# EasyEDA schematic Zad1SpaceSystems.json
TITLE: Zad1_STM32; REV: 1.0; Date: 2022-11-03; Sheet: 1/1; Company: AGH
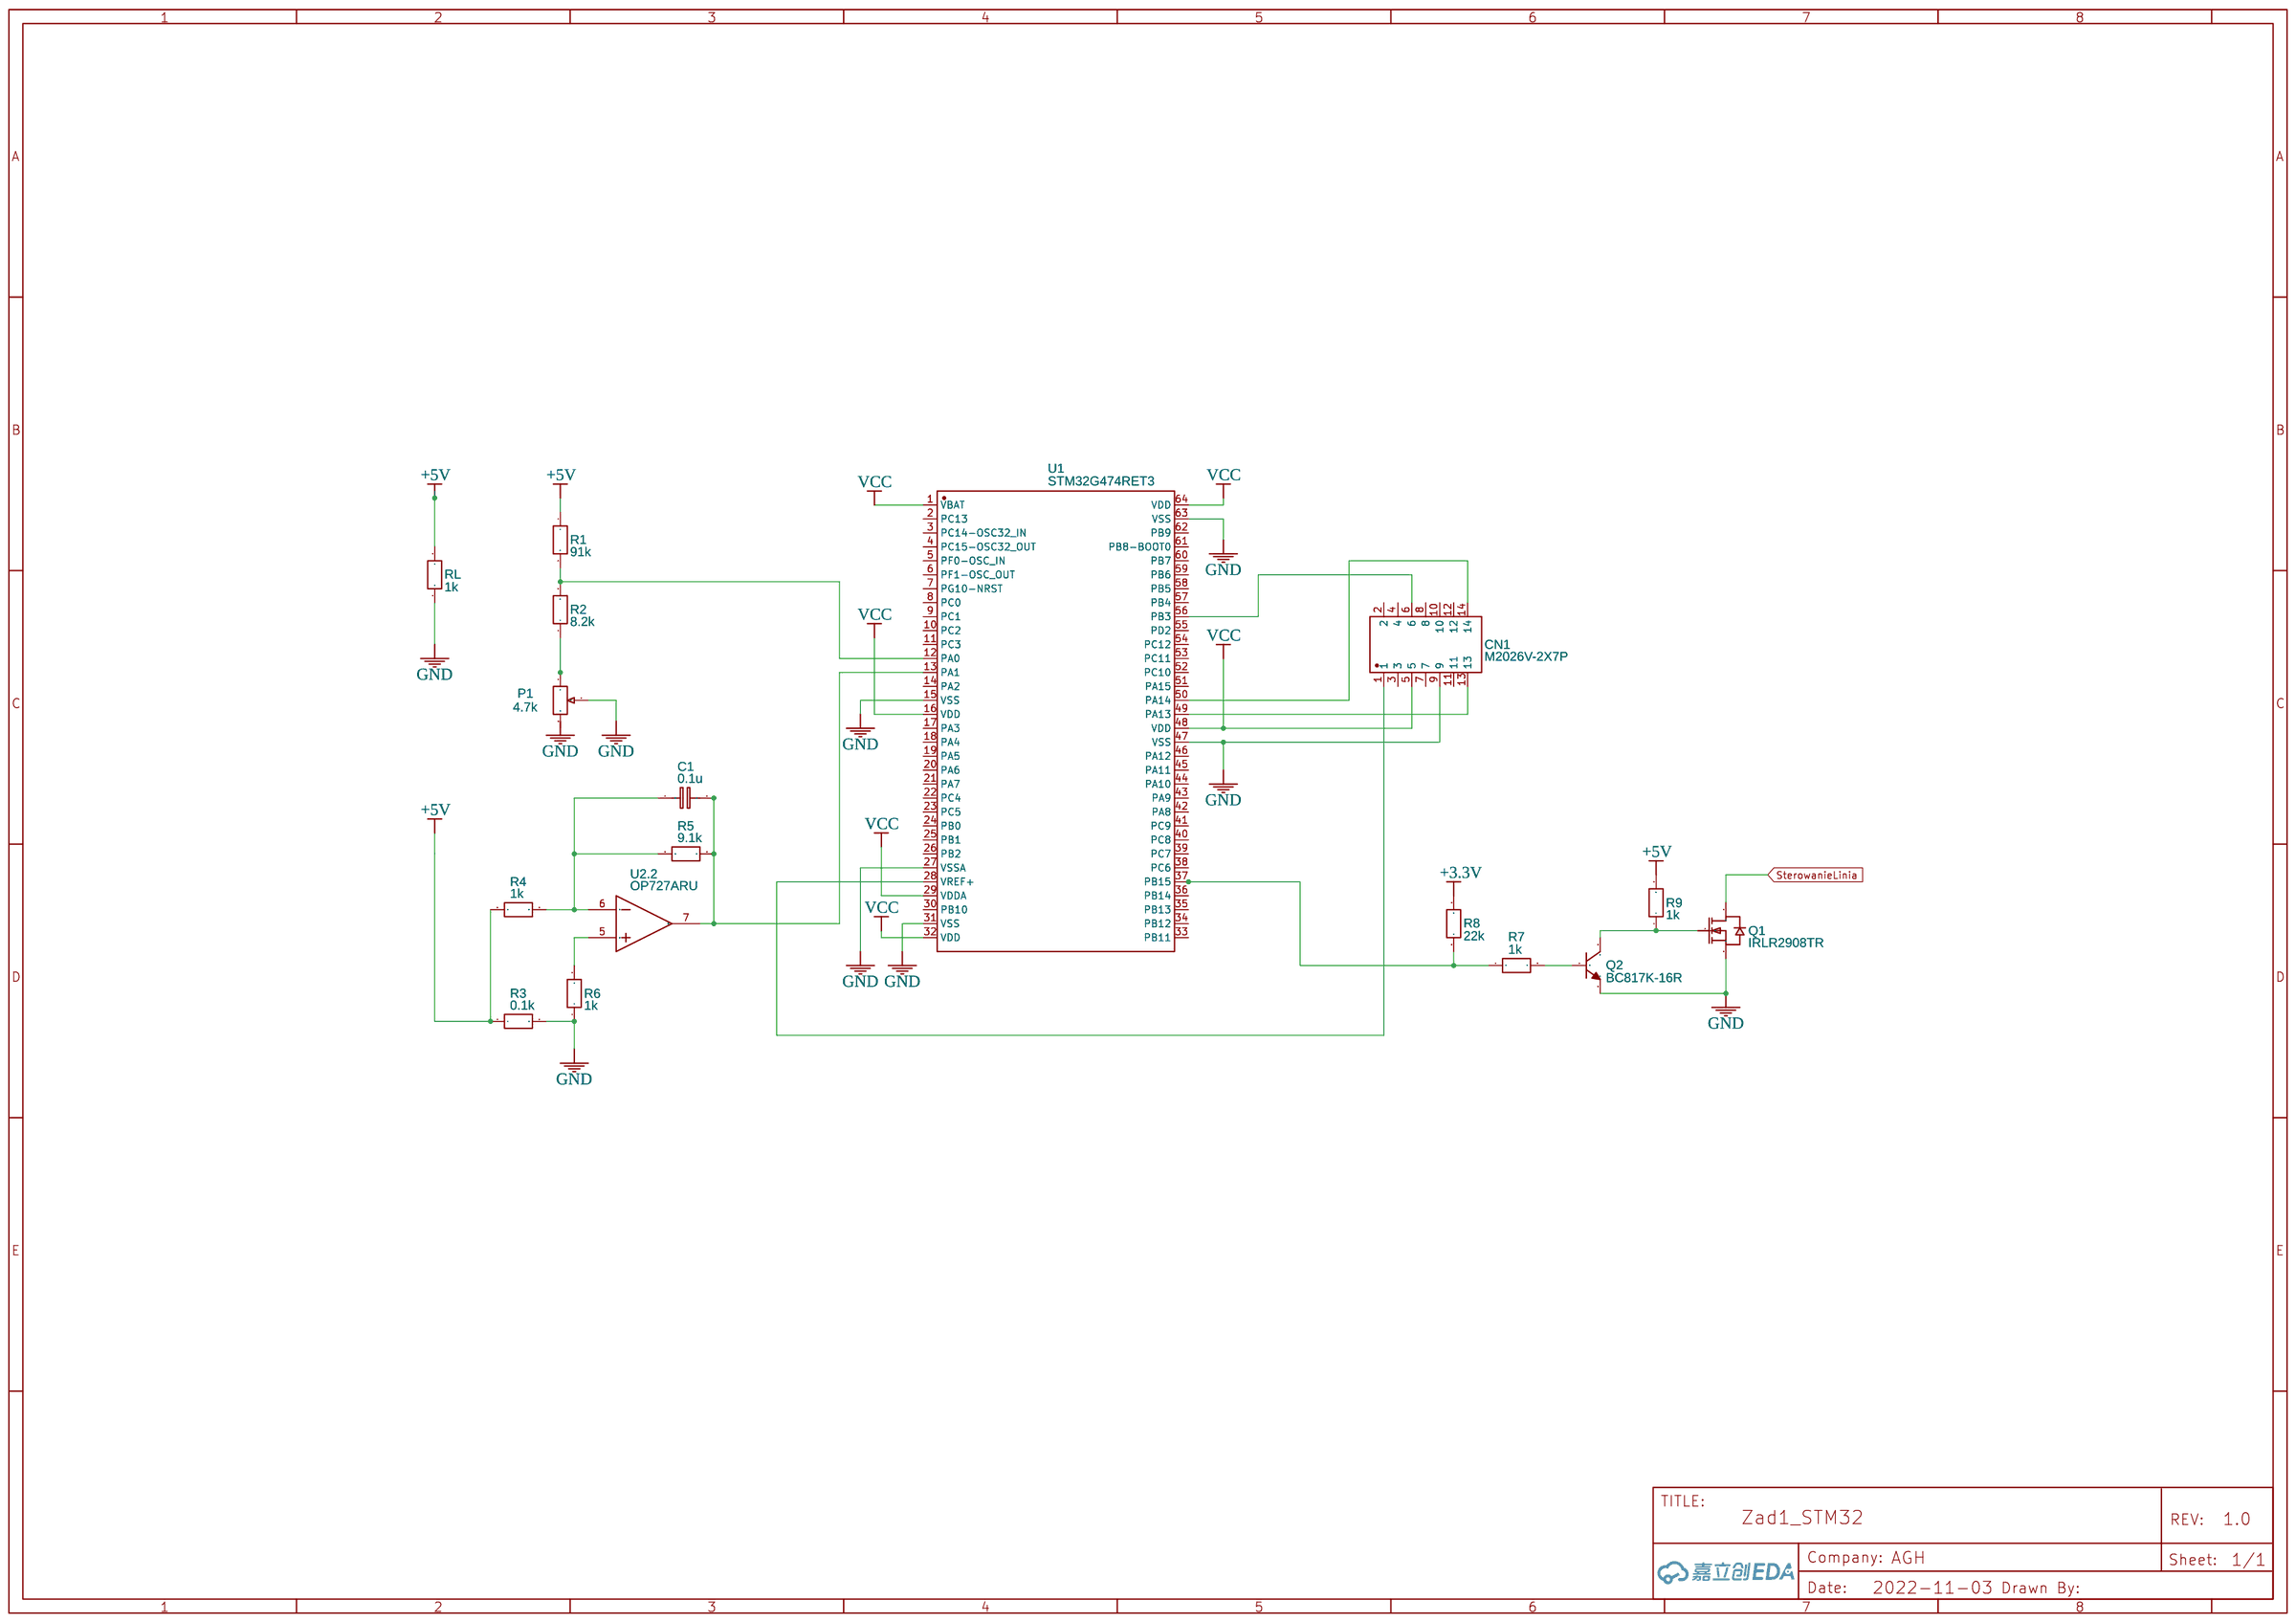
[diagram p0: schematic sheet]

## Parts
C1  0.1u  [C0603]
CN1  M2026V-2X7P  [CONN-TH_M2026V-2X7P]
P1  4.7k  [RES-ADJ-TH_3386P]
Q1  IRLR2908TR  [TO-252-2_L6.6-W6.1-P4.57-LS9.9-BR-CW]
Q2  BC817K-16R  [SOT-23-3_L2.9-W1.3-P1.90-LS2.4-BR]
R1  91k  [R0603]
R2  8.2k  [R0603]
R3  0.1k  [R0603]
R4  1k  [R0603]
R5  9.1k  [R0603]
R6  1k  [R0603]
R7  1k  [R0603]
R8  22k  [R0603]
R9  1k  [R0603]
RL  1k  [R0603]
U1  STM32G474RET3  [LQFP-64_L10.0-W10.0-P0.50-LS12.0-BL]
U2  OP727ARU  [TSSOP-8_L4.4-W3.0-P0.65-LS6.4-BL]  (section 2)

## Library data of the parts
C1 = C_0603_EU: Contributor: LCEDA_Lib
CN1 = M2026V-2X7P: Supplier: LCSC; Supplier Part: C492584; Manufacturer: XFCN; Manufacturer Part: M2026V-2x7P; Contributor: LCSC; JLCPCB Part Class: Extended Part
P1 = R_3386P_EU: Supplier: LCSC; Contributor: LCEDA_Lib; Value(Ω): 10K
Q1 = IRLR2908TR: Supplier: LCSC; Supplier Part: C693224; Manufacturer: VBsemi(微碧); Contributor: LCSC; JLCPCB Part Class: Extended Part
Q2 = BC817K-16R: Supplier: LCSC; Supplier Part: C549441; Manufacturer: Nexperia(安世); Contributor: LCSC; JLCPCB Part Class: Extended Part
R1-R9 RL = R_0603_EU: Contributor: LCEDA_Lib
U1 = STM32G474RET3: Supplier: LCSC; Supplier Part: C1236669; Manufacturer: ST(意法半导体); Contributor: LCSC; JLCPCB Part Class: Extended Part
U2 = OP727ARU: Supplier: LCSC; Supplier Part: C4366704; Manufacturer: ADI(亚德诺)/LINEAR(凌特); link: https://atta.szlcsc.comnull; subpart_no: 2; JLCPCB Part Class: Extended Part

## Nets
+3.3V: R8.2
+5V: R1.1 R3.1 R4.1 R9.2 RL.2
GND: CN1.9 P1.2 Q1.3(S) Q2.2(E) R3.2 R6.1 RL.1 U1.15(VSS) U1.27(VSSA) U1.31(VSS) U1.47(VSS) U1.63(VSS)
VCC: CN1.5 U1.1(VBAT) U1.16(VDD) U1.29(VDDA) U1.32(VDD) U1.48(VDD) U1.64(VDD)
SterowanieLinia: Q1.2(D)
Net-(C1-1): C1.1 R4.2 R5.1 U2.6(IN B-)
Net-(C1-2): C1.2 R5.2 U1.13(PA1) U2.7(OUT B)
Net-(CN1-1): CN1.1 U1.28(VREF+)
Net-(CN1-6): CN1.6 U1.56(PB3)
Net-(CN1-13): CN1.13 U1.49(PA13)
Net-(CN1-14): CN1.14 U1.50(PA14)
Net-(P1-1): P1.1 R2.1
Net-(Q1-1): Q1.1(G) Q2.3(C) R9.1
Net-(Q2-1): Q2.1(B) R7.2
Net-(R1-2): R1.2 R2.2 U1.12(PA0)
Net-(R6-2): R6.2 U2.5(IN B+)
Net-(R7-1): R7.1 R8.1 U1.37(PB15)

Not connected (* = marked no-connect by the designer): CN1 2 3 4 7 8 10 11 12; P1 3; U1 2(PC13) 3(PC14-OSC32_IN) 4(PC15-OSC32_OUT) 5(PF0-OSC_IN) 6(PF1-OSC_OUT) 7(PG10-NRST) 8(PC0) 9(PC1) 10(PC2) 11(PC3) 14(PA2) 17(PA3) 18(PA4) 19(PA5) 20(PA6) 21(PA7) 22(PC4) 23(PC5) 24(PB0) 25(PB1) 26(PB2) 30(PB10) 33(PB11) 34(PB12) 35(PB13) 36(PB14) 38(PC6) 39(PC7) 40(PC8) 41(PC9) 42(PA8) 43(PA9) 44(PA10) 45(PA11) 46(PA12) 51(PA15) 52(PC10) 53(PC11) 54(PC12) 55(PD2) 57(PB4) 58(PB5) 59(PB6) 60(PB7) 61(PB8-BOOT0) 62(PB9)
